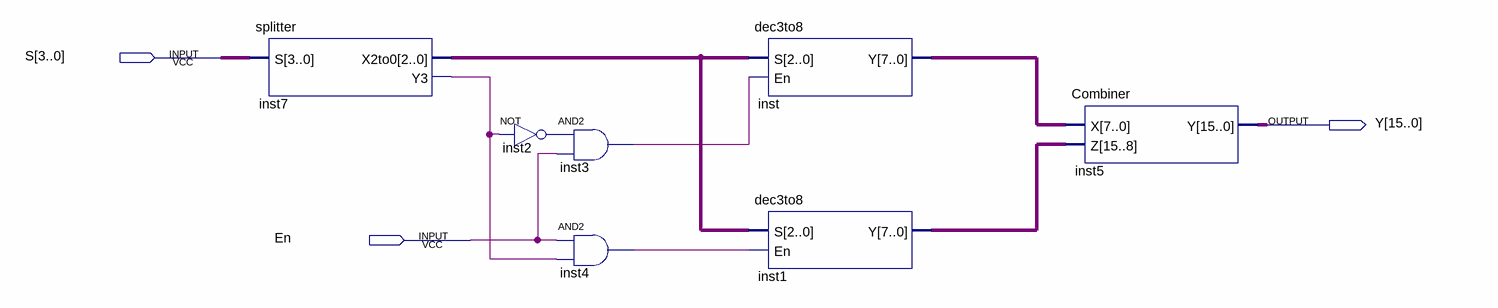
[diagram p0: schematic sheet]
// Quartus schematic dec4to16.bdf as structural Verilog: 7 symbols, 3 pins
module dec4to16 (
  input  [3:0] S,
  input  En,
  output [15:0] Y
);

  wire inst2_out, inst3_out, inst4_out, inst7_y3;
  wire [2:0] inst7_x2to0;
  wire [7:0] inst1_y, inst_y;

  splitter inst7 (.S(S), .X2to0(inst7_x2to0), .Y3(inst7_y3));
  not inst2 (inst2_out, inst7_y3);
  and inst3 (inst3_out, inst2_out, En);
  and inst4 (inst4_out, En, inst7_y3);
  dec3to8 inst (.S(inst7_x2to0), .En(inst3_out), .Y(inst_y));
  dec3to8 inst1 (.S(inst7_x2to0), .En(inst4_out), .Y(inst1_y));
  Combiner inst5 (.X(inst_y), .Z(inst1_y), .Y(Y));
endmodule
